# Altium schematic sheet MCU.SchDoc
size B; SheetNumber: 1; SheetTotal: 5
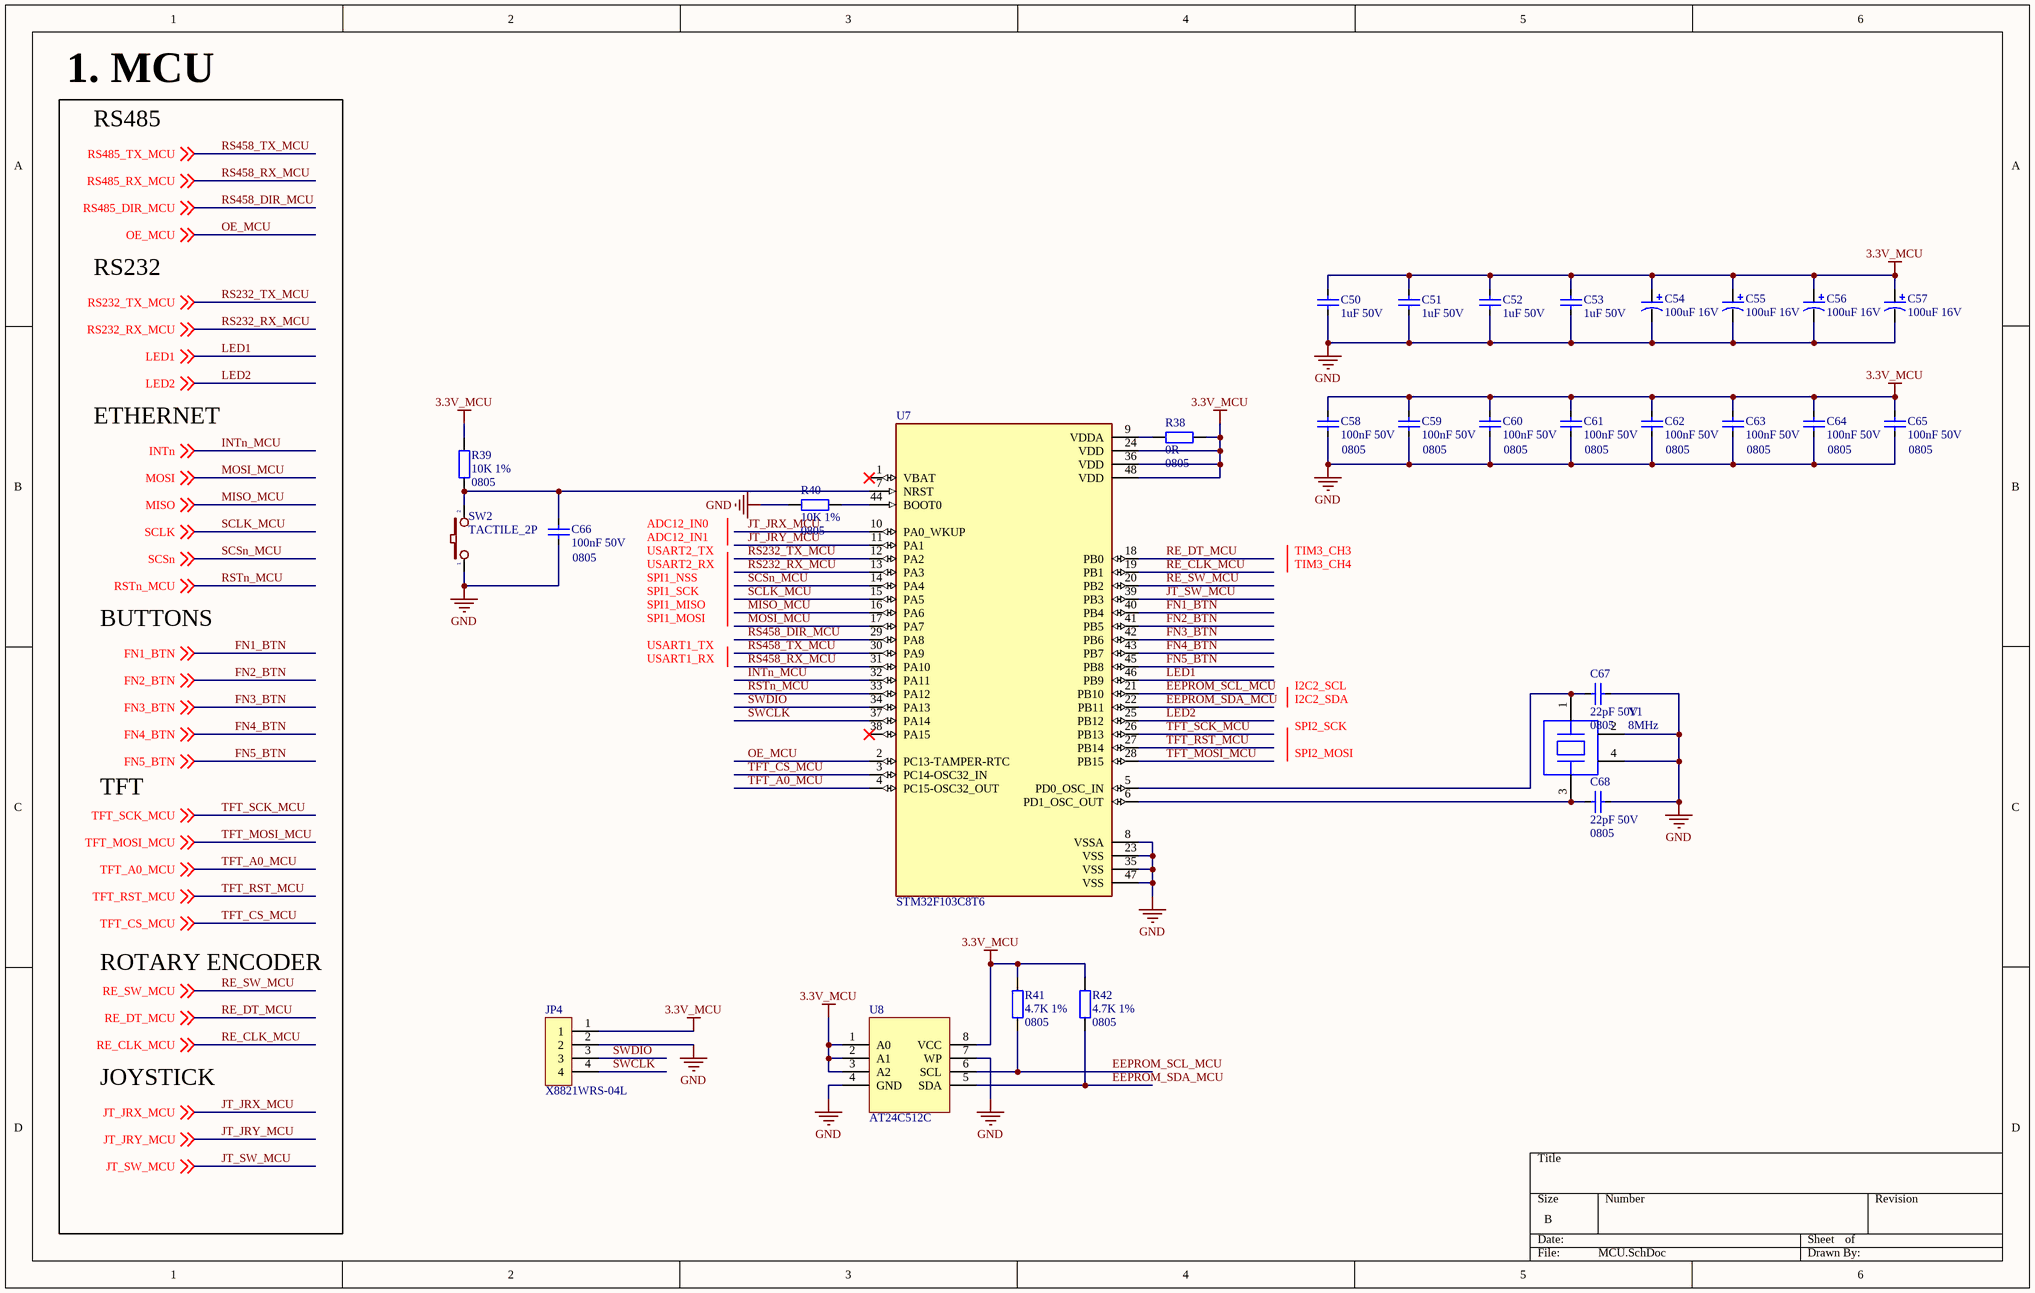
[diagram p0: MCU.SchDoc]

## Parts
C50  1uF 50V  [CAP_SMD_0805]
C51  1uF 50V  [CAP_SMD_0805]
C52  1uF 50V  [CAP_SMD_0805]
C53  1uF 50V  [CAP_SMD_0805]
C54  100uF 16V  [CAP-ALU-SMD-D]
C55  100uF 16V  [CAP-ALU-SMD-D]
C56  100uF 16V  [CAP-ALU-SMD-D]
C57  100uF 16V  [CAP-ALU-SMD-D]
C58  100nF 50V  Size: 0805  [CAP_SMD_0805]
C59  100nF 50V  Size: 0805  [CAP_SMD_0805]
C60  100nF 50V  Size: 0805  [CAP_SMD_0805]
C61  100nF 50V  Size: 0805  [CAP_SMD_0805]
C62  100nF 50V  Size: 0805  [CAP_SMD_0805]
C63  100nF 50V  Size: 0805  [CAP_SMD_0805]
C64  100nF 50V  Size: 0805  [CAP_SMD_0805]
C65  100nF 50V  Size: 0805  [CAP_SMD_0805]
C66  100nF 50V  Size: 0805  [CAP_SMD_0805]
C67  22pF 50V  Size: 0805  [CAP_SMD_0805]
C68  22pF 50V  Size: 0805  [CAP_SMD_0805]
JP4  X8821WRS-04L  [CONN_X8821WRS-04L-LPSN]
R38  0R  Size: 0805  [RES_SMD_0805]
R39  10K 1%  Size: 0805  [RES_SMD_0805]
R40  10K 1%  Size: 0805  [RES_SMD_0805]
R41  4.7K 1%  Size: 0805  [RES_SMD_0805]
R42  4.7K 1%  Size: 0805  [RES_SMD_0805]
SW2  TACTILE_2P  [C&K BUTTON 2P]
U7  STM32F103C8T6  [LQFP-48]
U8  AT24C512C  [SOIC-8]
Y1  8MHz  [SMD-3225_4P]

## Nets
3.3V_MCU: C50.2 C51.2 C52.2 C53.2 C54.1 C55.1 C56.1 C57.1 C58.2 C59.2 C60.2 C61.2 C62.2 C63.2 C64.2 C65.2 JP4.1 R38.2 R39.2 R41.2 R42.2 U7.24(VDD) U7.36(VDD) U7.48(VDD) U8.1(A0) U8.2(A1) U8.3(A2) U8.8(VCC)
GND: C50.1 C51.1 C52.1 C53.1 C54.2 C55.2 C56.2 C57.2 C58.1 C59.1 C60.1 C61.1 C62.1 C63.1 C64.1 C65.1 C66.1 C67.1 C68.1 JP4.2 R40.1 SW2.1 U7.8(VSSA) U7.23(VSS) U7.35(VSS) U7.47(VSS) U8.4(GND) U8.7(WP) Y1.2 Y1.4
EEPROM_SCL_MCU: R41.1 U7.21(PB10) U8.6(SCL)
EEPROM_SDA_MCU: R42.1 U7.22(PB11) U8.5(SDA)
FN1_BTN: U7.40(PB4) ; off-sheet FN1_BTN
FN2_BTN: U7.41(PB5) ; off-sheet FN2_BTN
FN3_BTN: U7.42(PB6) ; off-sheet FN3_BTN
FN4_BTN: U7.43(PB7) ; off-sheet FN4_BTN
FN5_BTN: U7.45(PB8) ; off-sheet FN5_BTN
INTn_MCU: U7.32(PA11) ; off-sheet INTn  [also labelled INTn]
JT_JRX_MCU: U7.10(PA0_WKUP) ; off-sheet JT_JRX_MCU
JT_JRY_MCU: U7.11(PA1) ; off-sheet JT_JRY_MCU
JT_SW_MCU: U7.39(PB3) ; off-sheet JT_SW_MCU
LED1: U7.46(PB9) ; off-sheet LED1
LED2: U7.25(PB12) ; off-sheet LED2
MISO_MCU: U7.16(PA6) ; off-sheet MISO  [also labelled MISO]
MOSI_MCU: U7.17(PA7) ; off-sheet MOSI  [also labelled MOSI]
OE_MCU: U7.2(PC13-TAMPER-RTC) ; off-sheet OE_MCU
RE_CLK_MCU: U7.19(PB1) ; off-sheet RE_CLK_MCU
RE_DT_MCU: U7.18(PB0) ; off-sheet RE_DT_MCU
RE_SW_MCU: U7.20(PB2) ; off-sheet RE_SW_MCU
RS232_RX_MCU: U7.13(PA3) ; off-sheet RS232_RX_MCU
RS232_TX_MCU: U7.12(PA2) ; off-sheet RS232_TX_MCU
RS458_DIR_MCU: U7.29(PA8) ; off-sheet RS485_DIR_MCU  [also labelled RS485_DIR_MCU]
RS458_RX_MCU: U7.31(PA10) ; off-sheet RS485_RX_MCU  [also labelled RS485_RX_MCU]
RS458_TX_MCU: U7.30(PA9) ; off-sheet RS485_TX_MCU  [also labelled RS485_TX_MCU]
RSTn_MCU: U7.33(PA12) ; off-sheet RSTn_MCU
SCLK_MCU: U7.15(PA5) ; off-sheet SCLK  [also labelled SCLK]
SCSn_MCU: U7.14(PA4) ; off-sheet SCSn  [also labelled SCSn]
SWCLK: JP4.4 U7.37(PA14)
SWDIO: JP4.3 U7.34(PA13)
TFT_A0_MCU: U7.4(PC15-OSC32_OUT) ; off-sheet TFT_A0_MCU
TFT_CS_MCU: U7.3(PC14-OSC32_IN) ; off-sheet TFT_CS_MCU
TFT_MOSI_MCU: U7.28(PB15) ; off-sheet TFT_MOSI_MCU
TFT_RST_MCU: U7.27(PB14) ; off-sheet TFT_RST_MCU
TFT_SCK_MCU: U7.26(PB13) ; off-sheet TFT_SCK_MCU
NetC66_2: C66.2 R39.1 SW2.2 U7.7(NRST)
NetC67_2: C67.2 U7.5(PD0_OSC_IN) Y1.1
NetC68_2: C68.2 U7.6(PD1_OSC_OUT) Y1.3
NetR38_1: R38.1 U7.9(VDDA)
NetR40_2: R40.2 U7.44(BOOT0)

Not connected (* = marked no-connect by the designer): U7 1(VBAT)* 38(PA15)*

## Notes on the sheet
- 1. MCU
- RS485
- RS232
- ETHERNET
- USART2_TX
- USART2_RX
- ADC12_IN0
- ADC12_IN1
- TIM3_CH3
- TIM3_CH4
- BUTTONS
- SPI1_NSS
- SPI1_SCK
- SPI1_MISO
- SPI1_MOSI
- USART1_TX
- USART1_RX
- I2C2_SCL
- I2C2_SDA
- SPI2_SCK
- SPI2_MOSI
- TFT
- ROTARY ENCODER
- JOYSTICK

## Library data of the parts
C50-C53 = C0805_MLCC_1uF_50V: 1 µF ±10% 50V Ceramic Capacitor X7R 0805 (2012 Metric); Manufacturer: Samsung Electro-Mechanics; Manufacture Part Number: CL21B105KBFNNNG; Packaging: Cut Tape (CT); Link: https://www.digikey.cn/en/products/detail/samsung-electro-mechanics/CL21B105KBFNNNG/3894467; Price: $0.11; Size: 0805
C54-C57 = C_ALU_100uF_16V: 100uF 16V 63mA@120Hz ±20% SMD,D6.3xL5.4mm Aluminum Electrolytic Capacitors - SMD ROHS; Manufacturer: DMBJ; Manufacture Part Number: RVT1C101M0605 100UF 16V; Link: https://www.lcsc.com/product-detail/Aluminum-Electrolytic-Capacitors-SMD_DMBJ-RVT1C101M0605-100UF-16V_C970684.html; Price: $1.37
C58-C66 = C0805_MLCC_100nF_50V: 0.1 µF ±10% 50V Ceramic Capacitor X7R 0805 (2012 Metric); Manufacturer: YAGEO; Manufacture Part Number: CC0805KRX7R9BB104; Packaging: Cut Tape (CT); Link: https://www.digikey.cn/en/products/detail/yageo/CC0805KRX7R9BB104/302874; Price: $0.10
C67 C68 = C0805_MLCC_22pF_50V: 22 pF ±1% 250V Ceramic Capacitor C0G, NP0 0805 (2012 Metric); Manufacturer: KYOCERA AVX; Manufacture Part Number: 600F220FT250XT; Packaging: Cut Tape (CT); Link: https://www.digikey.cn/en/products/detail/kyocera-avx/600F220FT250XT/3905100; Price: $2.26
JP4 = X8821WRS-04L: 1x4P 4P XH 1 Tin 2.5mm 4 3A Brass Surface Mount，Right Angle SMD,P=2.5mm,Surface Mount，Right Angle Wire To Board Connector ROHS; Manufacturer: XKB Connection; Manufacture Part Number: X8821WRS-04-9TSN; Link: https://www.lcsc.com/product-detail/Wire-To-Board-Connector_XKB-Connection-X8821WRS-04-9TSN_C397434.html; Price: $ 0.1564
R38 = R0805_0R: 0 Ohms Jumper Chip Resistor 0805 (2012 Metric) Automotive AEC-Q200 Thick Film; Manufacturer: Vishay Dale; Manufacture Part Number: CRCW08050000Z0EA; Packaging: Cut Tape (CT); Link: https://www.digikey.cn/en/products/detail/vishay-dale/CRCW08050000Z0EA/1175125; Price: $0.10
R39 R40 = R0805_10K: 10 kOhms ±1% 0.125W, 1/8W Chip Resistor 0805 (2012 Metric) Moisture Resistant Thick Film; Manufacturer: YAGEO; Manufacture Part Number: RC0805FR-0710KL; Packaging: Cut Tape (CT); Price: $0.10; Link: https://www.digikey.cn/en/products/detail/yageo/RC0805FR-0710KL/727535
R41 R42 = R0805_4.7K: 4.7 kOhms ±1% 0.125W, 1/8W Chip Resistor 0805 (2012 Metric) Thick Film; Manufacturer: Vishay Dale; Manufacture Part Number: CRCW08054K70FKEAC; Packaging: Cut Tape (CT); Link: https://www.digikey.com/en/products/detail/vishay-dale/CRCW08054K70FKEAC/7928553; Price: $0.10
SW2 = SWITCH_TACTILE_2P: Tactile Switch SPST-NO Top Actuated Surface Mount; Manufacturer: C&K; Manufacture Part Number: PTS636 SM43 SMTR LFS; Packaging: Cut Tape (CT); Link: https://www.digikey.com/en/products/detail/c-k/PTS636-SM43-SMTR-LFS/10071723; Price: $0.19
U7 = STM32F103C8T6: ARM® Cortex®-M3 STM32F1 Microcontroller IC 32-Bit Single-Core 72MHz 64KB (64K x 8) FLASH; Manufacturer: STMicroelectronics; Manufacture Part Number: STM32F103C8T6; Packaging: Tray; Link: https://www.digikey.cn/en/products/detail/stmicroelectronics/STM32F103C8T6/1646338; Price: $6.11
U8 = EEPROM_512K_AT24C512C: 512Kbit I2C SOIC-8 EEPROM ROHS; Manufacturer: Microchip Tech; Manufacture Part Number: AT24C512C-SSHD-T; Packaging: Cut Tape; Link: https://www.lcsc.com/product-detail/EEPROM_Microchip-Tech-AT24C512C-SSHD-T_C12371.html; Price: $ 0.58
Y1 = C3225_8MHz: 8MHz 贴片晶振 12pF ±10ppm ±20ppm SMD3225-4P Crystals ROHS; Manufacturer: YXC Crystal Oscillators; Manufacture Part Number: X32258MOB4SI; Packaging: Cut Tape; ComponentLink1Description: New link; ComponentLink1URL: *; Link: https://www.lcsc.com/product-detail/Crystals_YXC-span-style-background-color-ff0-Crystal-span-Oscillators-X32258MOB4SI_C2682775.html; Price: $ 0.1426